# Altium schematic sheet filters.SchDoc
size 381 x 241 mm; SheetNumber: 1; SheetTotal: 5
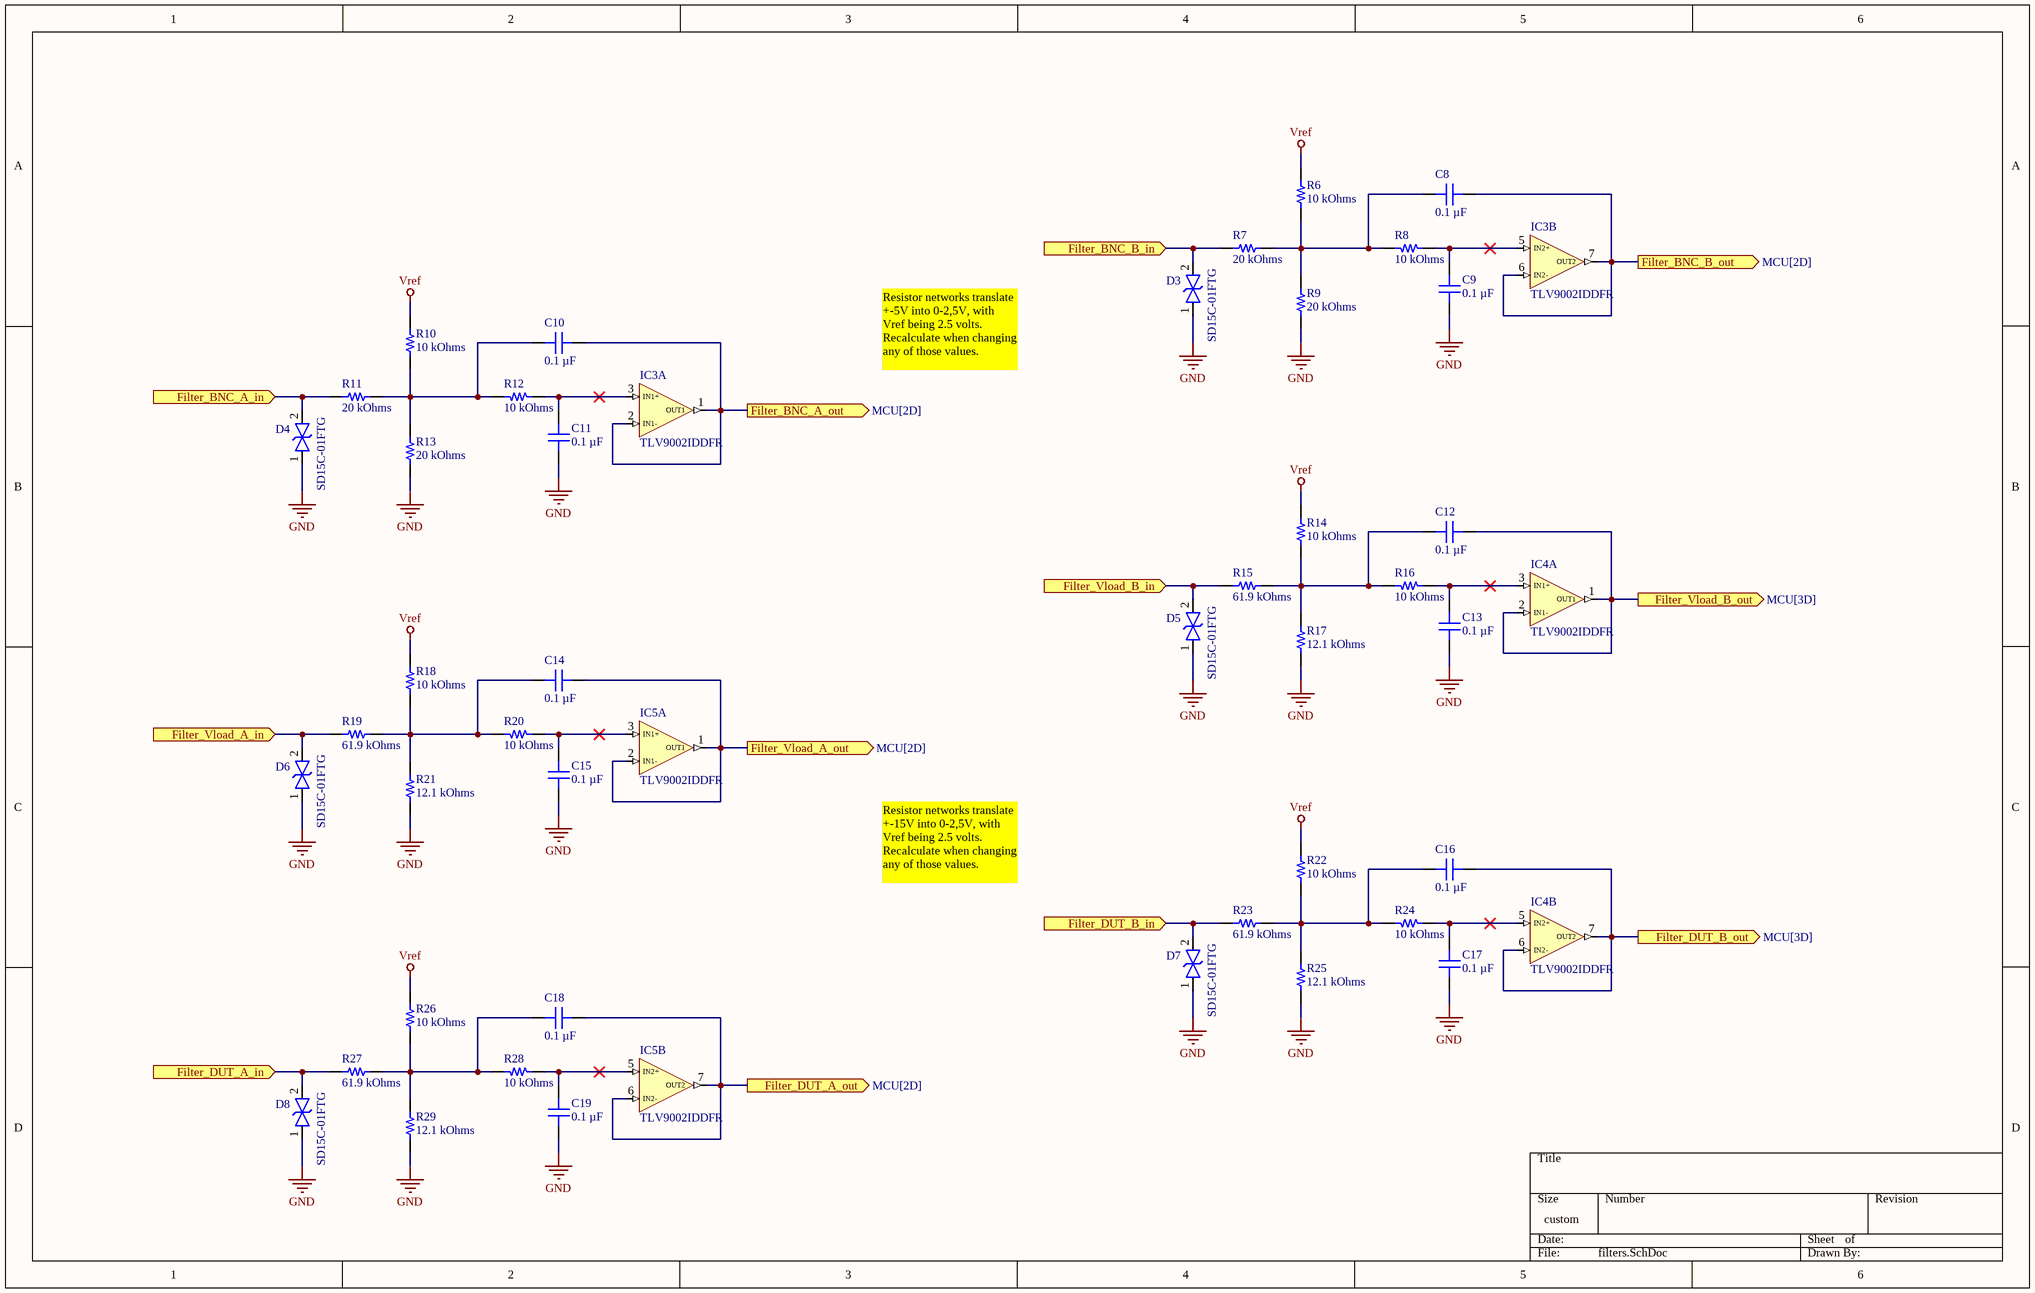
[diagram p0: filters.SchDoc]

## Parts
C8  0.1 µF  [CAP 1206_3216 - 0.8MM]
C9  0.1 µF  [CAP 1206_3216 - 0.8MM]
C10  0.1 µF  [CAP 1206_3216 - 0.8MM]
C11  0.1 µF  [CAP 1206_3216 - 0.8MM]
C12  0.1 µF  [CAP 1206_3216 - 0.8MM]
C13  0.1 µF  [CAP 1206_3216 - 0.8MM]
C14  0.1 µF  [CAP 1206_3216 - 0.8MM]
C15  0.1 µF  [CAP 1206_3216 - 0.8MM]
C16  0.1 µF  [CAP 1206_3216 - 0.8MM]
C17  0.1 µF  [CAP 1206_3216 - 0.8MM]
C18  0.1 µF  [CAP 1206_3216 - 0.8MM]
C19  0.1 µF  [CAP 1206_3216 - 0.8MM]
D3  SD15C-01FTG  [SD15C01FTG]
D4  SD15C-01FTG  [SD15C01FTG]
D5  SD15C-01FTG  [SD15C01FTG]
D6  SD15C-01FTG  [SD15C01FTG]
D7  SD15C-01FTG  [SD15C01FTG]
D8  SD15C-01FTG  [SD15C01FTG]
IC3  TLV9002IDDFR  [SOT65P280X110-8N]  (parts A,B of 3)
IC4  TLV9002IDDFR  [SOT65P280X110-8N]  (parts A,B of 3)
IC5  TLV9002IDDFR  [SOT65P280X110-8N]  (parts A,B of 3)
R6  10 kOhms  [RES 1206_3216]
R7  20 kOhms  [RES 1206_3216]
R8  10 kOhms  [YAGEO RES 1206_3216]
R9  20 kOhms  [RES 1206_3216]
R10  10 kOhms  [RES 1206_3216]
R11  20 kOhms  [RES 1206_3216]
R12  10 kOhms  [YAGEO RES 1206_3216]
R13  20 kOhms  [RES 1206_3216]
R14  10 kOhms  [RES 1206_3216]
R15  61.9 kOhms  [RES 1206_3216]
R16  10 kOhms  [YAGEO RES 1206_3216]
R17  12.1 kOhms  [RES 1206_3216]
R18  10 kOhms  [RES 1206_3216]
R19  61.9 kOhms  [RES 1206_3216]
R20  10 kOhms  [YAGEO RES 1206_3216]
R21  12.1 kOhms  [RES 1206_3216]
R22  10 kOhms  [RES 1206_3216]
R23  61.9 kOhms  [RES 1206_3216]
R24  10 kOhms  [YAGEO RES 1206_3216]
R25  12.1 kOhms  [RES 1206_3216]
R26  10 kOhms  [RES 1206_3216]
R27  61.9 kOhms  [RES 1206_3216]
R28  10 kOhms  [YAGEO RES 1206_3216]
R29  12.1 kOhms  [RES 1206_3216]

## Ports
Filter_BNC_A_in (in), Filter_BNC_A_out (out, see MCU[2D]), Filter_BNC_B_in (in), Filter_BNC_B_out (out, see MCU[2D]), Filter_DUT_A_in (in), Filter_DUT_A_out (out, see MCU[2D]), Filter_DUT_B_in (in), Filter_DUT_B_out (out, see MCU[3D]), Filter_Vload_A_in (in), Filter_Vload_A_out (out, see MCU[2D]), Filter_Vload_B_in (in), Filter_Vload_B_out (out, see MCU[3D])

## Nets
GND: C9.2 C11.2 C13.2 C15.2 C17.2 C19.2 D3.1 D4.1 D5.1 D6.1 D7.1 D8.1 R9.2 R13.2 R17.2 R21.2 R25.2 R29.2
Vref: R6.1 R10.1 R14.1 R18.1 R22.1 R26.1
Filter_BNC_A_in: D4.2 R11.1 ; port Filter_BNC_A_in
Filter_BNC_A_out: C10.1 IC3.1(OUT1) IC3.2(IN1-) ; port Filter_BNC_A_out
Filter_BNC_B_in: D3.2 R7.1 ; port Filter_BNC_B_in
Filter_BNC_B_out: C8.1 IC3.6(IN2-) IC3.7(OUT2) ; port Filter_BNC_B_out
Filter_DUT_A_in: D8.2 R27.1 ; port Filter_DUT_A_in
Filter_DUT_A_out: C18.1 IC5.6(IN2-) IC5.7(OUT2) ; port Filter_DUT_A_out
Filter_DUT_B_in: D7.2 R23.1 ; port Filter_DUT_B_in
Filter_DUT_B_out: C16.1 IC4.6(IN2-) IC4.7(OUT2) ; port Filter_DUT_B_out
Filter_Vload_A_in: D6.2 R19.1 ; port Filter_Vload_A_in
Filter_Vload_A_out: C14.1 IC5.1(OUT1) IC5.2(IN1-) ; port Filter_Vload_A_out
Filter_Vload_B_in: D5.2 R15.1 ; port Filter_Vload_B_in
Filter_Vload_B_out: C12.1 IC4.1(OUT1) IC4.2(IN1-) ; port Filter_Vload_B_out
NetC8_2: C8.2 R6.2 R7.2 R8.2 R9.1
NetC9_1: C9.1 IC3.5(IN2+) R8.1
NetC10_2: C10.2 R10.2 R11.2 R12.2 R13.1
NetC11_1: C11.1 IC3.3(IN1+) R12.1
NetC12_2: C12.2 R14.2 R15.2 R16.2 R17.1
NetC13_1: C13.1 IC4.3(IN1+) R16.1
NetC14_2: C14.2 R18.2 R19.2 R20.2 R21.1
NetC15_1: C15.1 IC5.3(IN1+) R20.1
NetC16_2: C16.2 R22.2 R23.2 R24.2 R25.1
NetC17_1: C17.1 IC4.5(IN2+) R24.1
NetC18_2: C18.2 R26.2 R27.2 R28.2 R29.1
NetC19_1: C19.1 IC5.5(IN2+) R28.1

## Notes on the sheet
- Resistor networks translate +-5V into 0-2,5V, with Vref being 2.5 volts. Recalculate when changing any of those values.
- Resistor networks translate +-15V into 0-2,5V, with Vref being 2.5 volts. Recalculate when changing any of those values.

## Library data of the parts
C8-C19 = 885012208087: CAP CER 0.1UF 50V X7R 1206; manufacturer: Würth Elektronik; Tolerance: ±10%; Part Number: 885012208087; Capacitance: 0.1 µF; Applications: General Purpose; componentlink1description: Datasheet; componentlink1url: https://katalog.we-online.de/pbs/datasheet/885012208087.pdf; componentlink2description: DigiKey Link; componentlink2url: https://www.digikey.com/en/products/detail/würth-elektronik/885012208087/5453982; Device Package: 1206 (3216 Metric); lastupdated: 6/4/2024 19:10:27; Lifecycle Status: Active; Minimum Order: 1; Mounting Type: Surface Mount, MLCC; Operating Temperature: -55°C ~ 125°C; Package / Case: 1206 (3216 Metric); packaging: TapeAndReel; partid: 20879; Part Status: Active; price: 0.06; series: WCAP-CSGP; Size / Dimension: 0.126" L x 0.063" W (3.20mm x 1.60mm); Supplier 1: DigiKey; Supplier Part Number 1: 732-8127-1-ND; Temperature Coefficient: X7R; Thickness (Max): 0.035" (0.90mm); value: 0.1 µF; Voltage - Rated: 50V
D3-D8 = SD15C-01FTG: TVS Diode (Bi-directional); Manufacturer_Name: LITTELFUSE; Datasheet Link: https://www.arrow.com/en/products/sd15c-01ftg/littelfuse; Height: 1.14mm; Manufacturer_Part_Number: SD15C-01FTG; Mouser Part Number: 576-SD15C-01FTG; Mouser Price/Stock: https://www.mouser.co.uk/ProductDetail/Littelfuse/SD15C-01FTG?qs=4zl93aaztU8pjSvpxpJP6g%3D%3D; Arrow Part Number: SD15C-01FTG; Arrow Price/Stock: https://www.arrow.com/en/products/sd15c-01ftg/littelfuse?region=nac
IC3-IC5 = TLV9002IDDFR: Integrated Circuit; Manufacturer_Name: Texas Instruments; Datasheet Link: https://www.ti.com/lit/gpn/TLV9002; Height: 1.1mm; Manufacturer_Part_Number: TLV9002IDDFR; Mouser Part Number: 595-TLV9002IDDFR; Mouser Price/Stock: https://www.mouser.co.uk/ProductDetail/Texas-Instruments/TLV9002IDDFR?qs=mAH9sUMRCtuVJ6NmNV%252Bgrw%3D%3D; Arrow Part Number: TLV9002IDDFR; Arrow Price/Stock: https://www.arrow.com/en/products/tlv9002iddfr/texas-instruments?utm_currency=USD&region=nac
R6 R10 R14 R18 R22 R26 = ERA-8AEB103V: RES SMD 10K OHM 0.1% 1/4W 1206; Manufacturer: Panasonic Electronic Components; Power (Watts): 0.25W, 1/4W; Temperature Coefficient: ±25ppm/°C; Part Number: ERA-8AEB103V; ComponentLink1Description: Datasheet; ComponentLink1URL: https://industrial.panasonic.com/cdbs/www-data/pdf/RDM0000/AOA0000C307.pdf; ComponentLink2Description: DigiKey Link; ComponentLink2URL: https://www.digikey.com/en/products/detail/panasonic-electronic-components/ERA-8AEB103V/3070742; Composition: Thin Film; Device Package: 1206 (3216 Metric); Features: Automotive AEC-Q200; Height - Seated (Max): 0.028" (0.70mm); LastUpdated: 2/9/2024 20:54:17; Lifecycle Status: Active; Minimum Order: 1; Number of Terminations: 2; Operating Temperature: -55°C ~ 155°C; Package / Case: 1206 (3216 Metric); Packaging: TapeAndReel; PartId: 33990; Part Status: Active; Price: 0.10; Ratings: AEC-Q200; Resistance: 10 kOhms; Series: ERA-8A; Size / Dimension: 0.126" L x 0.063" W (3.20mm x 1.60mm); Supplier 1: DigiKey; Supplier Part Number 1: P10KBCCT-ND; Supplier Device Package: 1206; Tolerance: ±0.1%; Value: 10 kOhms
R7 R9 R11 R13 = ERA-8AEB203V: RES SMD 20K OHM 0.1% 1/4W 1206; Manufacturer: Panasonic Electronic Components; Power (Watts): 0.25W, 1/4W; Temperature Coefficient: ±25ppm/°C; Part Number: ERA-8AEB203V; ComponentLink1Description: Datasheet; ComponentLink1URL: https://industrial.panasonic.com/cdbs/www-data/pdf/RDM0000/AOA0000C307.pdf; ComponentLink2Description: DigiKey Link; ComponentLink2URL: https://www.digikey.com/en/products/detail/panasonic-electronic-components/ERA-8AEB203V/3070867; Composition: Thin Film; Device Package: 1206 (3216 Metric); Features: Automotive AEC-Q200; Height - Seated (Max): 0.028" (0.70mm); LastUpdated: 2/9/2024 20:54:17; Lifecycle Status: Active; Minimum Order: 1; Number of Terminations: 2; Operating Temperature: -55°C ~ 155°C; Package / Case: 1206 (3216 Metric); Packaging: TapeAndReel; PartId: 33988; Part Status: Active; Price: 0.10; Ratings: AEC-Q200; Resistance: 20 kOhms; Series: ERA-8A; Size / Dimension: 0.126" L x 0.063" W (3.20mm x 1.60mm); Supplier 1: DigiKey; Supplier Part Number 1: P20KBCCT-ND; Supplier Device Package: 1206; Tolerance: ±0.1%; Value: 20 kOhms
R8 R12 R16 R20 R24 R28 = RT1206FRE0710KL: RES SMD 10K OHM 1% 1/4W 1206; Manufacturer: Yageo; Power (Watts): 0.25W, 1/4W; Temperature Coefficient: ±50ppm/°C; Part Number: RT1206FRE0710KL; ComponentLink1Description: Datasheet; ComponentLink1URL: https://www.yageo.com/upload/media/product/productsearch/datasheet/rchip/PYu-RT_1-to-0.01_RoHS_L_11.pdf; ComponentLink2Description: DigiKey Link; ComponentLink2URL: https://www.digikey.com/en/products/detail/yageo/RT1206FRE0710KL/1082868; Composition: Thin Film; Device Package: 1206 (3216 Metric); Height - Seated (Max): 0.026" (0.65mm); LastUpdated: 7/25/2024 09:21:28; Lifecycle Status: Active; Minimum Order: 1; Number of Terminations: 2; Operating Temperature: -55°C ~ 155°C; Package / Case: 1206 (3216 Metric); Packaging: TapeAndReel; PartId: 38903; Part Status: Active; Price: 0.01; Resistance: 10 kOhms; Series: RT; Size / Dimension: 0.122" L x 0.063" W (3.10mm x 1.60mm); Supplier 1: DigiKey; Supplier Part Number 1: YAG1242CT-ND; Supplier Device Package: 1206; Tolerance: ±1%; Value: 10 kOhms
R15 R19 R23 R27 = ERA-8AEB6192V: RES SMD 61.9K OHM 0.1% 1/4W 1206; Manufacturer: Panasonic Electronic Components; Power (Watts): 0.25W, 1/4W; Temperature Coefficient: ±25ppm/°C; Part Number: ERA-8AEB6192V; ComponentLink1Description: Datasheet; ComponentLink1URL: https://industrial.panasonic.com/cdbs/www-data/pdf/RDM0000/AOA0000C307.pdf; ComponentLink2Description: DigiKey Link; ComponentLink2URL: https://www.digikey.com/en/products/detail/panasonic-electronic-components/ERA-8AEB6192V/3071114; Composition: Thin Film; Device Package: 1206 (3216 Metric); Features: Automotive AEC-Q200; Height - Seated (Max): 0.028" (0.70mm); LastUpdated: 2/9/2024 20:53:52; Lifecycle Status: Active; Minimum Order: 1; Number of Terminations: 2; Operating Temperature: -55°C ~ 155°C; Package / Case: 1206 (3216 Metric); Packaging: TapeAndReel; PartId: 41065; Part Status: Active; Price: 0.10; Ratings: AEC-Q200; Resistance: 61.9 kOhms; Series: ERA-8A; Size / Dimension: 0.126" L x 0.063" W (3.20mm x 1.60mm); Supplier 1: DigiKey; Supplier Part Number 1: P61.9KBCCT-ND; Supplier Device Package: 1206; Tolerance: ±0.1%; Value: 61.9 kOhms
R17 R21 R25 R29 = ERA-8AEB1212V: RES SMD 12.1K OHM 0.1% 1/4W 1206; Manufacturer: Panasonic Electronic Components; Power (Watts): 0.25W, 1/4W; Temperature Coefficient: ±25ppm/°C; Part Number: ERA-8AEB1212V; ComponentLink1Description: Datasheet; ComponentLink1URL: https://industrial.panasonic.com/cdbs/www-data/pdf/RDM0000/AOA0000C307.pdf; ComponentLink2Description: DigiKey Link; ComponentLink2URL: https://www.digikey.com/en/products/detail/panasonic-electronic-components/ERA-8AEB1212V/3070771; Composition: Thin Film; Device Package: 1206 (3216 Metric); Features: Automotive AEC-Q200; Height - Seated (Max): 0.028" (0.70mm); LastUpdated: 2/9/2024 20:54:30; Lifecycle Status: Active; Minimum Order: 1; Number of Terminations: 2; Operating Temperature: -55°C ~ 155°C; Package / Case: 1206 (3216 Metric); Packaging: TapeAndReel; PartId: 30396; Part Status: Active; Price: 0.10; Ratings: AEC-Q200; Resistance: 12.1 kOhms; Series: ERA-8A; Size / Dimension: 0.126" L x 0.063" W (3.20mm x 1.60mm); Supplier 1: DigiKey; Supplier Part Number 1: 10-ERA-8AEB1212VCT-ND; Supplier Device Package: 1206; Tolerance: ±0.1%; Value: 12.1 kOhms